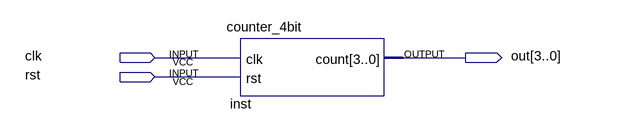
[diagram p0: schematic sheet]
// Quartus schematic Block3.bdf as structural Verilog: 1 symbols, 3 pins
module Block3 (
  input  clk,
  input  rst,
  output [3:0] out
);

  counter_4bit inst (.clk(clk), .rst(rst), .count(out));
endmodule
